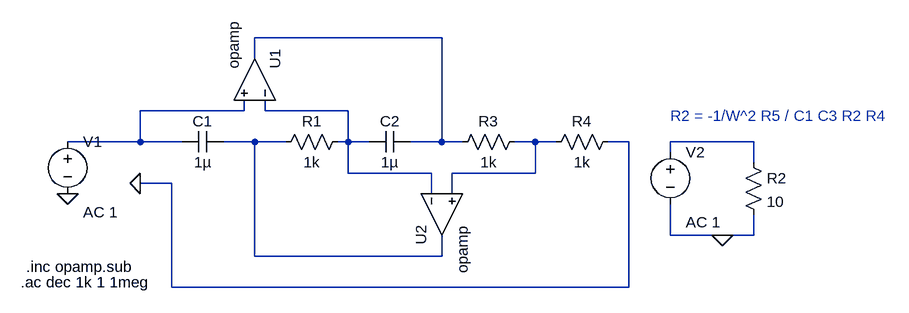
[diagram p0: schematic EJE5_C.asc]
EJE5_C.asc, the LTspice schematic file:
Version 4
SHEET 1 1108 680
WIRE 384 16 96 16
WIRE 96 48 96 16
WIRE 80 128 80 112
WIRE 80 128 -80 128
WIRE 112 128 112 112
WIRE 240 128 112 128
WIRE -80 176 -80 128
WIRE -80 176 -192 176
WIRE -16 176 -80 176
WIRE 96 176 48 176
WIRE 144 176 96 176
WIRE 240 176 240 128
WIRE 240 176 224 176
WIRE 272 176 240 176
WIRE 384 176 384 16
WIRE 384 176 336 176
WIRE 416 176 384 176
WIRE 528 176 496 176
WIRE 560 176 528 176
WIRE 672 176 640 176
WIRE 864 176 736 176
WIRE 736 192 736 176
WIRE 864 208 864 176
WIRE 240 224 240 176
WIRE 368 224 240 224
WIRE 528 224 528 176
WIRE 528 224 400 224
WIRE -32 240 -80 240
WIRE 368 256 368 224
WIRE 400 256 400 224
WIRE 736 320 736 272
WIRE 816 320 736 320
WIRE 864 320 864 288
WIRE 864 320 816 320
WIRE 96 352 96 176
WIRE 384 352 384 320
WIRE 384 352 96 352
WIRE -32 400 -32 240
WIRE 672 400 672 176
WIRE 672 400 -32 400
FLAG -80 240 0
FLAG -192 256 0
FLAG 816 320 0
SYMBOL res 512 160 R90
WINDOW 0 0 56 VBottom 2
WINDOW 3 32 56 VTop 2
SYMATTR InstName R3
SYMATTR Value 1k
SYMBOL res 656 160 R90
WINDOW 0 0 56 VBottom 2
WINDOW 3 32 56 VTop 2
SYMATTR InstName R4
SYMATTR Value 1k
SYMBOL voltage -192 160 R0
WINDOW 123 24 124 Left 2
SYMATTR Value2 AC 1
SYMATTR InstName V1
SYMATTR Value ""
SYMBOL cap 48 160 R90
WINDOW 0 0 32 VBottom 2
WINDOW 3 32 32 VTop 2
SYMATTR InstName C1
SYMATTR Value 1µ
SYMBOL res 240 160 R90
WINDOW 0 0 56 VBottom 2
WINDOW 3 32 56 VTop 2
SYMATTR InstName R1
SYMATTR Value 1k
SYMBOL cap 336 160 R90
WINDOW 0 0 32 VBottom 2
WINDOW 3 32 32 VTop 2
SYMATTR InstName C2
SYMATTR Value 1µ
SYMBOL OpAmps\\opamp 160 80 M270
SYMATTR InstName U1
SYMBOL OpAmps\\opamp 320 288 M90
SYMATTR InstName U2
SYMBOL voltage 736 176 R0
WINDOW 123 24 124 Left 2
SYMATTR Value2 AC 1
SYMATTR InstName V2
SYMATTR Value ""
SYMBOL res 848 192 R0
SYMATTR InstName R2
SYMATTR Value 10
TEXT -264 392 Left 2 !.ac dec 1k 1 1meg
TEXT -256 368 Left 2 !.inc opamp.sub
TEXT 736 136 Left 2 ;R2 = -1/W^2 R5 / C1 C3 R2 R4

The netlist it stands for:
* EJE5_C.asc
R3 N005 N001 1k
R4 0 N005 1k
V1 N002 0 AC 1
C1 N004 N002 1µ
R1 N003 N004 1k
C2 N001 N003 1µ
XU1 N003 N002 N001 opamp Aol=100K GBW=10Meg  ; pins invin noninvin out
XU2 N003 N005 N004 opamp Aol=100K GBW=10Meg  ; pins invin noninvin out
V2 N006 0 AC 1
R2 N006 0 10
.ac dec 1k 1 1meg
.inc opamp.sub
* R2 = -1/W^2 R5 / C1 C3 R2 R4
.backanno
.end